# EAGLE design TG16 (EAGLE 7.7.0)
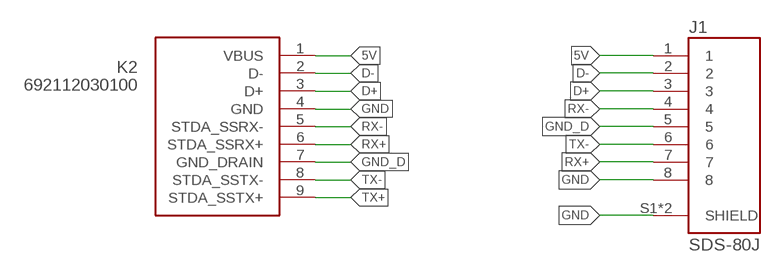
[diagram p0: schematic, sheet 1]

## Parts
J1  SDS-80J  [CUI_SDS-80J]
K2  692112030100  [692112030100]

## Nets
5V: J1.1 K2.1(VBUS)
D+: J1.3 K2.3(D+)
D-: J1.2 K2.2(D-)
GND: J1.8 J1.S1(SHIELD) J1.S2(SHIELD) K2.4(GND)
GND_D: J1.5 K2.7(GND_DRAIN)
RX+: J1.7 K2.6(STDA_SSRX+)
RX-: J1.4 K2.5(STDA_SSRX-)
TX+: K2.9(STDA_SSTX+)
TX-: J1.6 K2.8(STDA_SSTX-)

## Library data of the parts
J1 = SDS-80J:SDS-80J: Standard Din Connector 8 Pin, Right-Angle Receptacle; AVAILABILITY: Unavailable; CUI_PURCHASE_URL: https://www.cui.com/product/interconnect/connectors/din-connectors/sds-j-series?utm_source=snapeda.com&utm_medium=referral&utm_campaign=snapedaBOM; DESCRIPTION: 3~13 Positions, Receptacle, Right Angle, Through Hole, Standard Circular DIN Connector; MF: CUI Inc.; MP: SDS-80J; PACKAGE: None; PRICE: None
K2 = Wuerth_Elektronik_eiCan_Communication_Connectors_STENCIL:692112030100: WR-COM USB 3.0 SMT PLUG WITH CLIPTYPE A

## Board
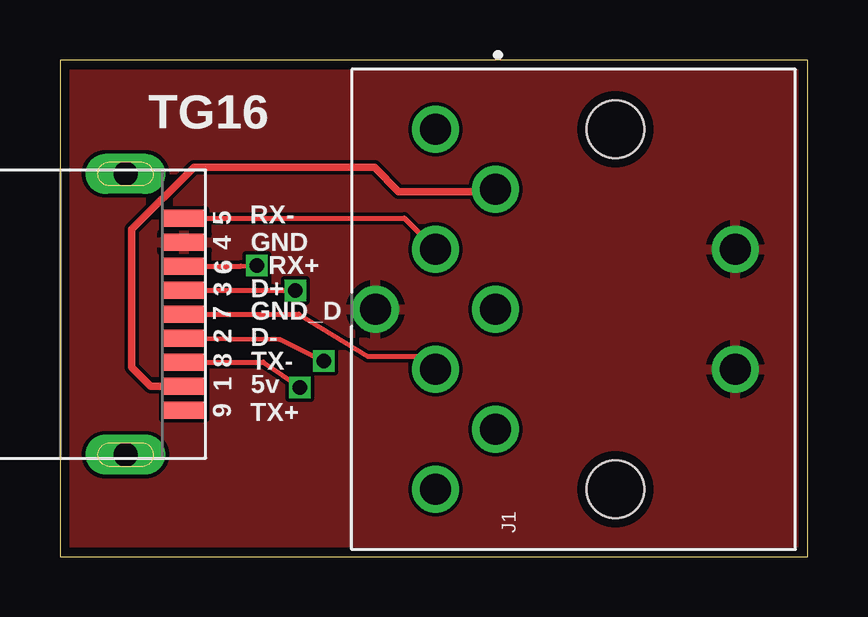
[diagram p1: board, top side]
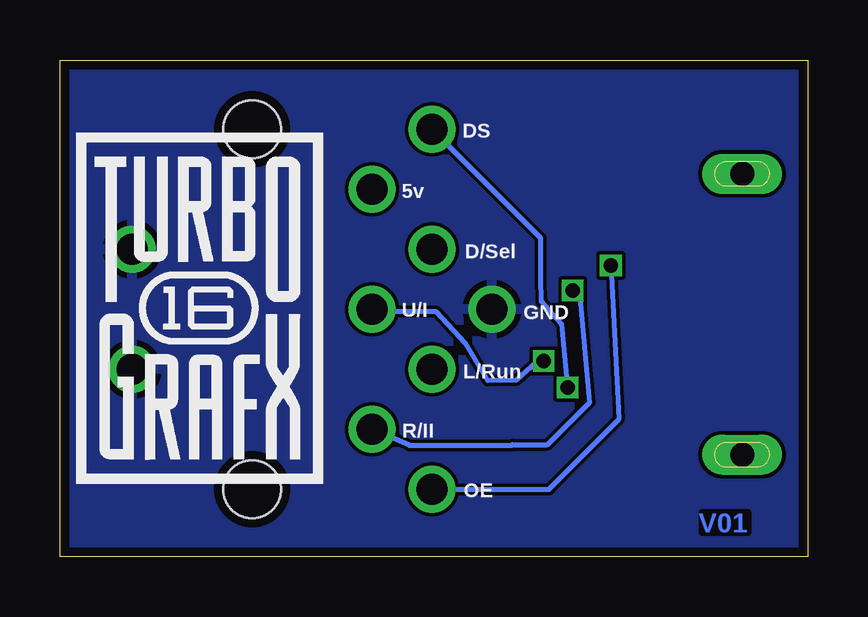
[diagram p2: board, bottom side, seen from below]

Size 31.17 x 20.7 mm. Coordinates in mm from the lower left corner, seen from the top.
Outline: 0,0 31.17,0 31.17,20.7 0,20.7 0,0
Copper layers (1*16): Top 0.035559375mm / dielectric 1.6mm / Bottom 0.035559375mm
Design rules "oshpark-2layer": minimum track width 6mil, minimum drill 10mil, track to track 6mil, track to pad 6mil, pad to pad 6mil, via to via 6mil, smd to smd 6mil, copper to edge 15mil, drill to drill 6mil, minimum pad ring 5mil, minimum via ring 5mil, stop-mask expansion 2.5mil, vias tented up to drill 0mil, thermal gap 10mil

### Footprints (pad centres in the part's own frame; a part is rotated, then mirrored left to right if it is on the bottom)
CUI_SDS-80J = drill 1.3: 1 5,0; 2 0,0; 3 -5,0; 4 2.5,2.5; 5 -2.5,2.5; 6 7.5,2.5; 7 -7.5,2.5; 8 0,5; S1 -2.5,-10; S2 2.5,-10 | hole 2.4: -7.5,-5; 7.5,-5
692112030100 = smd 0.7 x 1.8: 1 -3,0; 2 -1,0; 3 1,0; 4 3,0; 5 4,0; 6 2,0; 7 0,0; 8 -2,0; 9 -4,0 | drill 1 pad 1.676 long: Z1 5.85,2.45; Z2 -5.85,2.45

### Placement (x,y rotation side)
J1  18.16,10.31 90 top
K2  5.18,10.11 90 top

### Tracks (layer width: path | path; a pad name or v marks a point on that pad's centre or on a via)
5V
  Top 0.305: K2.1 3.79,7.11 3,7.9 3,13.64 5.59,16.23 13.11,16.23 14.12,15.21 18.06,15.21 J1.1
D+  (via drill 0.6)
  Top 0.203: K2.3 8.83,11.11 v9.8,11.1
  Bottom 0.203: v9.8,11.1 9.5,10.8 9.09,6.43 10.85,4.67 12.32,4.67 12.34,4.65 16.61,4.65 J1.3
D-  (via drill 0.6)
  Top 0.203: K2.2 9.15,9.06 v11,8.15
  Bottom 0.203: J1.2 18.06,10.21 15.47,10.21 14.28,8.89 13.34,7.34 12.14,7.37 11.3,8.1 v11,8.15
GND
  pour Bottom: -0.1,20.52 30.89,20.5 30.94,-0.08 0.1,-0.03
  pour Top: 0,20.55 30.96,20.6 30.84,0.25 0.05,0
GND_D
  Top 0.203: K2.7 9.96,10.11 12.83,8.36 15.12,8.36 J1.5
RX+  (via drill 0.6)
  Top 0.203: K2.6 7.55,12.11 v8.2,12.14
  Bottom 0.203: v8.2,12.14 7.87,5.72 10.78,2.81 J1.7
RX-
  Top 0.203: K2.5 14.36,14.11 J1.4
TX-  (via drill 0.6)
  Top 0.203: K2.8 8.48,8.11 v10.01,7.06
  Bottom 0.203: 15.68,17.83 J1.6 11.13,13.28 11.13,11.61 11.1,10.64 10.26,9.7 v10.01,7.06

### Text on the board
Bottom: V01
tPlace: TG16 | 5 | RX- | 4 | GND | 6 | RX+ | 3 | D+ | 7 | GND_D | 2 | D- | 8 | TX- | 1 | 5v | 9 | TX+
bPlace: DS | 5v | D/Sel | GND | U/I | L/Run | R/II | OE